# EasyEDA Pro project ProPrj_ch32v305_pico.epro, schematic 40%矮轴机械键盘 Cherry Low to TTC_1
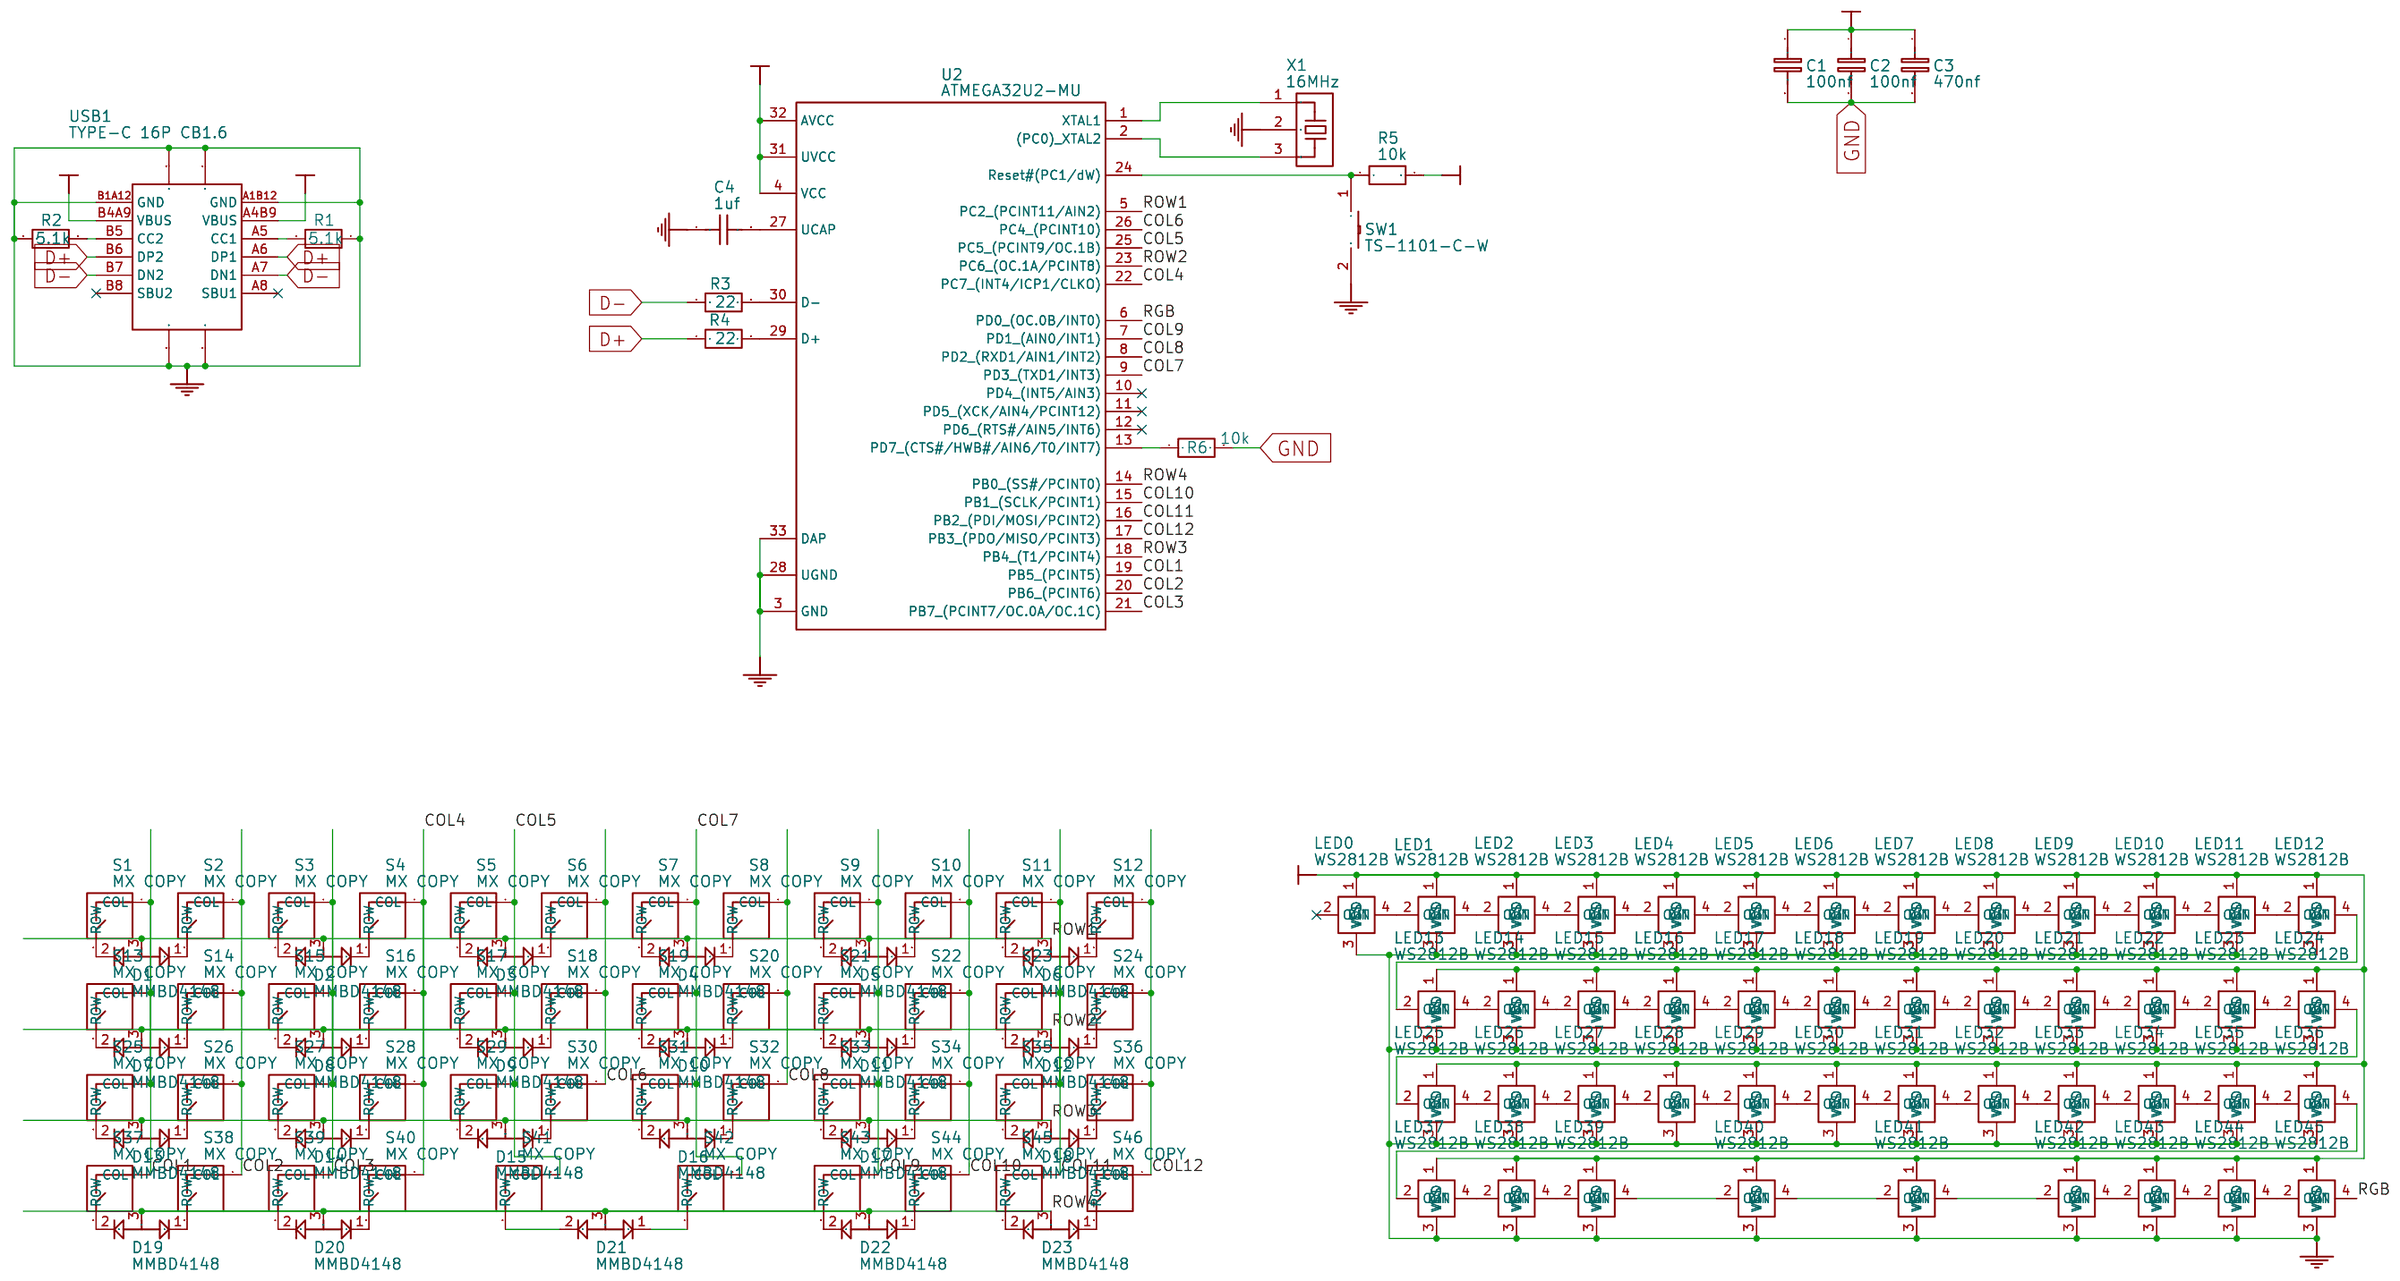
[diagram p3: schematic sheet]

## Parts
C1  100nf  [0603]
C2  100nf  [0603]
C3  470nf  [0603]
C4  1uf  [0603]
D1  MMBD4148  [SOT-23-3]
D2  MMBD4148  [SOT-23-3]
D3  MMBD4148  [SOT-23-3]
D4  MMBD4148  [SOT-23-3]
D5  MMBD4148  [SOT-23-3]
D6  MMBD4148  [SOT-23-3]
D7  MMBD4148  [SOT-23-3]
D8  MMBD4148  [SOT-23-3]
D9  MMBD4148  [SOT-23-3]
D10  MMBD4148  [SOT-23-3]
D11  MMBD4148  [SOT-23-3]
D12  MMBD4148  [SOT-23-3]
D13  MMBD4148  [SOT-23-3]
D14  MMBD4148  [SOT-23-3]
D15  MMBD4148  [SOT-23-3]
D16  MMBD4148  [SOT-23-3]
D17  MMBD4148  [SOT-23-3]
D18  MMBD4148  [SOT-23-3]
D19  MMBD4148  [SOT-23-3]
D20  MMBD4148  [SOT-23-3]
D21  MMBD4148  [SOT-23-3]
D22  MMBD4148  [SOT-23-3]
D23  MMBD4148  [SOT-23-3]
LED0  WS2812B  [WS2812 0807]
LED1  WS2812B  [WS2812 0807]
LED2  WS2812B  [WS2812 0807]
LED3  WS2812B  [WS2812 0807]
LED4  WS2812B  [WS2812 0807]
LED5  WS2812B  [WS2812 0807]
LED6  WS2812B  [WS2812 0807]
LED7  WS2812B  [WS2812 0807]
LED8  WS2812B  [WS2812 0807]
LED9  WS2812B  [WS2812 0807]
LED10  WS2812B  [WS2812 0807]
LED11  WS2812B  [WS2812 0807]
LED12  WS2812B  [WS2812 0807]
LED13  WS2812B  [WS2812 0807]
LED14  WS2812B  [WS2812 0807]
LED15  WS2812B  [WS2812 0807]
LED16  WS2812B  [WS2812 0807]
LED17  WS2812B  [WS2812 0807]
LED18  WS2812B  [WS2812 0807]
LED19  WS2812B  [WS2812 0807]
LED20  WS2812B  [WS2812 0807]
LED21  WS2812B  [WS2812 0807]
LED22  WS2812B  [WS2812 0807]
LED23  WS2812B  [WS2812 0807]
LED24  WS2812B  [WS2812 0807]
LED25  WS2812B  [WS2812 0807]
LED26  WS2812B  [WS2812 0807]
LED27  WS2812B  [WS2812 0807]
LED28  WS2812B  [WS2812 0807]
LED29  WS2812B  [WS2812 0807]
LED30  WS2812B  [WS2812 0807]
LED31  WS2812B  [WS2812 0807]
LED32  WS2812B  [WS2812 0807]
LED33  WS2812B  [WS2812 0807]
LED34  WS2812B  [WS2812 0807]
LED35  WS2812B  [WS2812 0807]
LED36  WS2812B  [WS2812 0807]
LED37  WS2812B  [WS2812 0807]
LED38  WS2812B  [WS2812 0807]
LED39  WS2812B  [WS2812 0807]
LED40  WS2812B  [WS2812 0807]
LED41  WS2812B  [WS2812 0807]
LED42  WS2812B  [WS2812 0807]
LED43  WS2812B  [WS2812 0807]
LED44  WS2812B  [WS2812 0807]
LED45  WS2812B  [WS2812 0807]
R1  5.1k  [0603]
R2  5.1k  [0603]
R3  22  [0603]
R4  22  [0603]
R5  10k  [0603]
R6  10k  [0603]
S1  MX COPY  [CHERRY-MX-LOW-PROFILE COPY]
S2  MX COPY  [CHERRY-MX-LOW-PROFILE COPY]
S3  MX COPY  [CHERRY-MX-LOW-PROFILE COPY]
S4  MX COPY  [CHERRY-MX-LOW-PROFILE COPY]
S5  MX COPY  [CHERRY-MX-LOW-PROFILE COPY]
S6  MX COPY  [CHERRY-MX-LOW-PROFILE COPY]
S7  MX COPY  [CHERRY-MX-LOW-PROFILE COPY]
S8  MX COPY  [CHERRY-MX-LOW-PROFILE COPY]
S9  MX COPY  [CHERRY-MX-LOW-PROFILE COPY]
S10  MX COPY  [CHERRY-MX-LOW-PROFILE COPY]
S11  MX COPY  [CHERRY-MX-LOW-PROFILE COPY]
S12  MX COPY  [CHERRY-MX-LOW-PROFILE COPY]
S13  MX COPY  [CHERRY-MX-LOW-PROFILE COPY]
S14  MX COPY  [CHERRY-MX-LOW-PROFILE COPY]
S15  MX COPY  [CHERRY-MX-LOW-PROFILE COPY]
S16  MX COPY  [CHERRY-MX-LOW-PROFILE COPY]
S17  MX COPY  [CHERRY-MX-LOW-PROFILE COPY]
S18  MX COPY  [CHERRY-MX-LOW-PROFILE COPY]
S19  MX COPY  [CHERRY-MX-LOW-PROFILE COPY]
S20  MX COPY  [CHERRY-MX-LOW-PROFILE COPY]
S21  MX COPY  [CHERRY-MX-LOW-PROFILE COPY]
S22  MX COPY  [CHERRY-MX-LOW-PROFILE COPY]
S23  MX COPY  [CHERRY-MX-LOW-PROFILE COPY]
S24  MX COPY  [CHERRY-MX-LOW-PROFILE COPY]
S25  MX COPY  [CHERRY-MX-LOW-PROFILE COPY]
S26  MX COPY  [CHERRY-MX-LOW-PROFILE COPY]
S27  MX COPY  [CHERRY-MX-LOW-PROFILE COPY]
S28  MX COPY  [CHERRY-MX-LOW-PROFILE COPY]
S29  MX COPY  [CHERRY-MX-LOW-PROFILE COPY]
S30  MX COPY  [CHERRY-MX-LOW-PROFILE COPY]
S31  MX COPY  [CHERRY-MX-LOW-PROFILE COPY]
S32  MX COPY  [CHERRY-MX-LOW-PROFILE COPY]
S33  MX COPY  [CHERRY-MX-LOW-PROFILE COPY]
S34  MX COPY  [CHERRY-MX-LOW-PROFILE COPY]
S35  MX COPY  [CHERRY-MX-LOW-PROFILE COPY]
S36  MX COPY  [CHERRY-MX-LOW-PROFILE COPY]
S37  MX COPY  [CHERRY-MX-LOW-PROFILE COPY]
S38  MX COPY  [CHERRY-MX-LOW-PROFILE COPY]
S39  MX COPY  [CHERRY-MX-LOW-PROFILE COPY]
S40  MX COPY  [CHERRY-MX-LOW-PROFILE COPY]
S41  MX COPY  [CHERRY-MX-LOW-PROFILE COPY]
S42  MX COPY  [CHERRY-MX-LOW-PROFILE COPY]
S43  MX COPY  [CHERRY-MX-LOW-PROFILE COPY]
S44  MX COPY  [CHERRY-MX-LOW-PROFILE COPY]
S45  MX COPY  [CHERRY-MX-LOW-PROFILE COPY]
S46  MX COPY  [CHERRY-MX-LOW-PROFILE COPY]
SW1  TS-1101-C-W  [SW-SMD_L6.0-W3.3-LS8.0]
U2  ATMEGA32U2-MU  [32U2-MU]
USB1  TYPE-C 16P CB1.6  [USB-C-SMD_TYPE-C-16P-CB1.6]
X1  16MHz  [OSC-SMD_3P-L3.2-W1.3-P0.95-L]

## Library data of the parts
C1 C2 = CC0805KRX7R9BB104: Supplier: LCSC; Manufacturer: YAGEO; Supplier Part: C49678; Origin 3D Model Title: L0603_L1.6-W0.8-H0.5_BEAD
C3 = CL21A475KAQNNNE: Supplier: LCSC; Manufacturer: SAMSUNG; Supplier Part: C1779; Origin 3D Model Title: L0603_L1.6-W0.8-H0.5_BEAD
C4 = 1uf: Origin 3D Model Title: L0603_L1.6-W0.8-H0.5_BEAD
D1-D23 = MMBD4148: Origin 3D Model Title: SOT-23-3L_L2.9-W1.6-H1.1-LS2.8-P0.95
LED0-LED45 = WS2812B: Supplier: LCSC
R1 R2 = CR-05JL7---5K1: Supplier: LCSC; Manufacturer: Viking Tech; Supplier Part: C416158; Origin 3D Model Title: L0603_L1.6-W0.8-H0.5_BEAD
R3 = 22: Origin 3D Model Title: L0603_L1.6-W0.8-H0.5_BEAD
R4 = 22
R5 R6 = 0805W8J0103T5E: Supplier: LCSC; Manufacturer: UniOhm; Supplier Part: C25612; Origin 3D Model Title: L0603_L1.6-W0.8-H0.5_BEAD
S1-S46 = MX COPY
SW1 = TS-1101-C-W: Supplier: LCSC; Supplier Part: C318938; Manufacturer: XKB Connectivity(中国星坤); Paste Type: expand; Assembly Type: smtWeld
U2 = ATMEGA32U2-MU: Supplier: LCSC; Manufacturer: MICROCHIP; Supplier Part: C57345; SMT Type: Extend; Origin 3D Model Title: QFN-32_L5.0-W5.0-H0.9-P0.50
USB1 = TYPE-C 16P CB1.6: Supplier: LCSC; Supplier Part: C2681554; Manufacturer: SHOU HAN(首韩)
X1 = CSTCE16M0V53-R0: Supplier: LCSC; Manufacturer: MuRata; Supplier Part: C32180; Paste Type: expand; Assembly Type: smtWeld; Origin 3D Model Title: OSC-SMD_3P-L3.2-W1.3-H0.8-P0.95

## Nets
GND: C1.2 C2.2 C3.2 C4.1 LED0.3(VSS) LED1.3(VSS) LED2.3(VSS) LED3.3(VSS) LED4.3(VSS) LED5.3(VSS) LED6.3(VSS) LED7.3(VSS) LED8.3(VSS) LED9.3(VSS) LED10.3(VSS) LED11.3(VSS) LED12.3(VSS) LED13.3(VSS) LED14.3(VSS) LED15.3(VSS) LED16.3(VSS) LED17.3(VSS) LED18.3(VSS) LED19.3(VSS) LED20.3(VSS) LED21.3(VSS) LED22.3(VSS) LED23.3(VSS) LED24.3(VSS) LED25.3(VSS) LED26.3(VSS) LED27.3(VSS) LED28.3(VSS) LED29.3(VSS) LED30.3(VSS) LED31.3(VSS) LED32.3(VSS) LED33.3(VSS) LED34.3(VSS) LED35.3(VSS) LED36.3(VSS) LED37.3(VSS) LED38.3(VSS) LED39.3(VSS) LED40.3(VSS) LED41.3(VSS) LED42.3(VSS) LED43.3(VSS) LED44.3(VSS) LED45.3(VSS) R1.1 R2.1 R6.2 SW1.2 U2.3(GND) U2.28(UGND) U2.33(DAP) USB1.13(EH) USB1.14(EH) USB1.15(EH) USB1.16(EH) USB1.A1B12(GND) USB1.B1A12(GND) X1.2
VCC: C1.1 C2.1 C3.1 LED0.1(VDD) LED1.1(VDD) LED2.1(VDD) LED3.1(VDD) LED4.1(VDD) LED5.1(VDD) LED6.1(VDD) LED7.1(VDD) LED8.1(VDD) LED9.1(VDD) LED10.1(VDD) LED11.1(VDD) LED12.1(VDD) LED13.1(VDD) LED14.1(VDD) LED15.1(VDD) LED16.1(VDD) LED17.1(VDD) LED18.1(VDD) LED19.1(VDD) LED20.1(VDD) LED21.1(VDD) LED22.1(VDD) LED23.1(VDD) LED24.1(VDD) LED25.1(VDD) LED26.1(VDD) LED27.1(VDD) LED28.1(VDD) LED29.1(VDD) LED30.1(VDD) LED31.1(VDD) LED32.1(VDD) LED33.1(VDD) LED34.1(VDD) LED35.1(VDD) LED36.1(VDD) LED37.1(VDD) LED38.1(VDD) LED39.1(VDD) LED40.1(VDD) LED41.1(VDD) LED42.1(VDD) LED43.1(VDD) LED44.1(VDD) LED45.1(VDD) R5.2 U2.4(VCC) U2.31(UVCC) U2.32(AVCC) USB1.A4B9(VBUS) USB1.B4A9(VBUS)
COL1: S1.1(COL) S13.1(COL) S25.1(COL) S37.1(COL) U2.19(PB5 (PCINT5))
COL2: S2.1(COL) S14.1(COL) S26.1(COL) S38.1(COL) U2.20(PB6 (PCINT6))
COL3: S3.1(COL) S15.1(COL) S27.1(COL) S39.1(COL) U2.21(PB7 (PCINT7/OC.0A/OC.1C))
COL4: S4.1(COL) S16.1(COL) S28.1(COL) S40.1(COL) U2.22(PC7 (INT4/ICP1/CLKO))
COL5: S5.1(COL) S17.1(COL) S29.1(COL) S41.1(COL) U2.25(PC5 (PCINT9/OC.1B))
COL6: S6.1(COL) S18.1(COL) S30.1(COL) U2.26(PC4 (PCINT10))
COL7: S7.1(COL) S19.1(COL) S31.1(COL) S42.1(COL) U2.9(PD3 (TXD1/INT3))
COL8: S8.1(COL) S20.1(COL) S32.1(COL) U2.8(PD2 (RXD1/AIN1/INT2))
COL9: S9.1(COL) S21.1(COL) S33.1(COL) S43.1(COL) U2.7(PD1 (AIN0/INT1))
COL10: S10.1(COL) S22.1(COL) S34.1(COL) S44.1(COL) U2.15(PB1 (SCLK/PCINT1))
COL11: S11.1(COL) S23.1(COL) S35.1(COL) S45.1(COL) U2.16(PB2 (PDI/MOSI/PCINT2))
COL12: S12.1(COL) S24.1(COL) S36.1(COL) S46.1(COL) U2.17(PB3 (PDO/MISO/PCINT3))
D+: R4.1 USB1.A6(DP1) USB1.B6(DP2)
D-: R3.1 USB1.A7(DN1) USB1.B7(DN2)
RGB: LED45.4(DIN) U2.6(PD0 (OC.0B/INT0))
ROW1: D1.3 D2.3 D3.3 D4.3 D5.3 D6.3 U2.5(PC2 (PCINT11/AIN2))
ROW2: D7.3 D8.3 D9.3 D10.3 D11.3 D12.3 U2.23(PC6 (OC.1A/PCINT8))
ROW3: D13.3 D14.3 D15.3 D16.3 D17.3 D18.3 U2.18(PB4 (T1/PCINT4))
ROW4: D19.3 D20.3 D21.3 D22.3 D23.3 U2.14(PB0 (SS#/PCINT0))
C4_2: C4.2 U2.27(UCAP)
LED1_2: LED0.4(DIN) LED1.2(OUT)
LED1_4: LED1.4(DIN) LED2.2(OUT)
LED2_4: LED2.4(DIN) LED3.2(OUT)
LED3_4: LED3.4(DIN) LED4.2(OUT)
LED4_4: LED4.4(DIN) LED5.2(OUT)
LED5_4: LED5.4(DIN) LED6.2(OUT)
LED6_4: LED6.4(DIN) LED7.2(OUT)
LED7_4: LED7.4(DIN) LED8.2(OUT)
LED8_4: LED8.4(DIN) LED9.2(OUT)
LED9_4: LED9.4(DIN) LED10.2(OUT)
LED10_4: LED10.4(DIN) LED11.2(OUT)
LED11_4: LED11.4(DIN) LED12.2(OUT)
LED12_4: LED12.4(DIN) LED13.2(OUT)
LED13_4: LED13.4(DIN) LED14.2(OUT)
LED14_4: LED14.4(DIN) LED15.2(OUT)
LED15_4: LED15.4(DIN) LED16.2(OUT)
LED16_4: LED16.4(DIN) LED17.2(OUT)
LED17_4: LED17.4(DIN) LED18.2(OUT)
LED18_4: LED18.4(DIN) LED19.2(OUT)
LED19_4: LED19.4(DIN) LED20.2(OUT)
LED20_4: LED20.4(DIN) LED21.2(OUT)
LED21_4: LED21.4(DIN) LED22.2(OUT)
LED22_4: LED22.4(DIN) LED23.2(OUT)
LED23_4: LED23.4(DIN) LED24.2(OUT)
LED24_4: LED24.4(DIN) LED25.2(OUT)
LED25_4: LED25.4(DIN) LED26.2(OUT)
LED26_4: LED26.4(DIN) LED27.2(OUT)
LED27_4: LED27.4(DIN) LED28.2(OUT)
LED28_4: LED28.4(DIN) LED29.2(OUT)
LED29_4: LED29.4(DIN) LED30.2(OUT)
LED30_4: LED30.4(DIN) LED31.2(OUT)
LED31_4: LED31.4(DIN) LED32.2(OUT)
LED32_4: LED32.4(DIN) LED33.2(OUT)
LED33_4: LED33.4(DIN) LED34.2(OUT)
LED34_4: LED34.4(DIN) LED35.2(OUT)
LED35_4: LED35.4(DIN) LED36.2(OUT)
LED36_4: LED36.4(DIN) LED37.2(OUT)
LED37_4: LED37.4(DIN) LED38.2(OUT)
LED38_4: LED38.4(DIN) LED39.2(OUT)
LED39_4: LED39.4(DIN) LED40.2(OUT)
LED40_4: LED40.4(DIN) LED41.2(OUT)
LED41_4: LED41.4(DIN) LED42.2(OUT)
LED42_4: LED42.4(DIN) LED43.2(OUT)
LED43_4: LED43.4(DIN) LED44.2(OUT)
LED44_4: LED44.4(DIN) LED45.2(OUT)
Net-(R5-1): R5.1 SW1.1 U2.24(Reset#(PC1/dW))
R1_2: R1.2 USB1.A5(CC1)
R2_2: R2.2 USB1.B5(CC2)
R3_2: R3.2 U2.30(D-)
R4_2: R4.2 U2.29(D+)
R6_1: R6.1 U2.13(PD7 (CTS#/HWB#/AIN6/T0/INT7))
S1_2: D1.2 S1.2(ROW)
S2_2: D1.1 S2.2(ROW)
S3_2: D2.2 S3.2(ROW)
S4_2: D2.1 S4.2(ROW)
S5_2: D3.2 S5.2(ROW)
S6_2: D3.1 S6.2(ROW)
S7_2: D4.2 S7.2(ROW)
S8_2: D4.1 S8.2(ROW)
S9_2: D5.2 S9.2(ROW)
S10_2: D5.1 S10.2(ROW)
S11_2: D6.2 S11.2(ROW)
S12_2: D6.1 S12.2(ROW)
S13_2: D7.2 S13.2(ROW)
S14_2: D7.1 S14.2(ROW)
S15_2: D8.2 S15.2(ROW)
S16_2: D8.1 S16.2(ROW)
S17_2: D9.2 S17.2(ROW)
S18_2: D9.1 S18.2(ROW)
S19_2: D10.2 S19.2(ROW)
S20_2: D10.1 S20.2(ROW)
S21_2: D11.2 S21.2(ROW)
S22_2: D11.1 S22.2(ROW)
S23_2: D12.2 S23.2(ROW)
S24_2: D12.1 S24.2(ROW)
S25_2: D13.2 S25.2(ROW)
S26_2: D13.1 S26.2(ROW)
S27_2: D14.2 S27.2(ROW)
S28_2: D14.1 S28.2(ROW)
S29_2: D15.2 S29.2(ROW)
S30_2: D15.1 S30.2(ROW)
S31_2: D16.2 S31.2(ROW)
S32_2: D16.1 S32.2(ROW)
S33_2: D17.2 S33.2(ROW)
S34_2: D17.1 S34.2(ROW)
S35_2: D18.2 S35.2(ROW)
S36_2: D18.1 S36.2(ROW)
S37_2: D19.2 S37.2(ROW)
S38_2: D19.1 S38.2(ROW)
S39_2: D20.2 S39.2(ROW)
S40_2: D20.1 S40.2(ROW)
S41_2: D21.2 S41.2(ROW)
S42_2: D21.1 S42.2(ROW)
S43_2: D22.2 S43.2(ROW)
S44_2: D22.1 S44.2(ROW)
S45_2: D23.2 S45.2(ROW)
S46_2: D23.1 S46.2(ROW)
U2_1: U2.1(XTAL1) X1.1
U2_2: U2.2((PC0) XTAL2) X1.3

Not connected (* = marked no-connect by the designer): LED0 2(OUT)*; U2 10(PD4 (INT5/AIN3))* 11(PD5 (XCK/AIN4/PCINT12))* 12(PD6 (RTS#/AIN5/INT6))*; USB1 A8(SBU1)* B8(SBU2)*
